# Altium project mach_relay_dao_chieu.PrjPcb
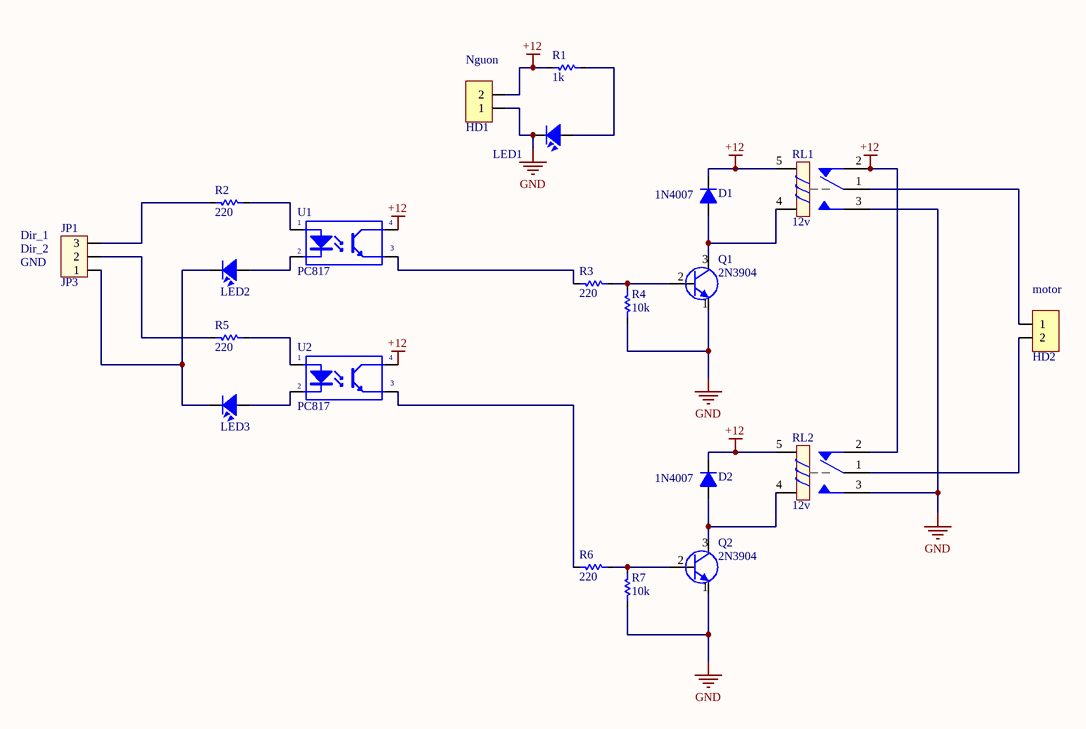
[diagram p0: mach_relay_dao_chieu.SchDoc]
1 sheet, 21 parts. Net scope: global (net labels, ports and power ports of the same name join across sheets).
Board file: mach_relay_dao_chieu.PcbDoc

## Sheet mach_relay_dao_chieu.SchDoc
size A; SheetNumber: 1; SheetTotal: 1

### Parts
D1  1N4007  [1N4007]
D2  1N4007  [1N4007]
HD1  Header 2  [KF301-2P]  (value not drawn)
HD2  Header 2  [KF301-2P]  (value not drawn)
JP1  JP3  [XH 2.54-3P]
LED1  LED  [LED-5MM-WHITE]  (value not drawn)
LED2  LED  [LED-5MM-WHITE]  (value not drawn)
LED3  LED  [LED-5MM-WHITE]  (value not drawn)
Q1  2N3904  [TO-92]
Q2  2N3904  [TO-92]
R1  1k  [RES-1/4W]
R2  220  [RES-1/4W]
R3  220  [RES-1/4W]
R4  10k  [RES-1/4W]
R5  220  [RES-1/4W]
R6  220  [RES-1/4W]
R7  10k  [RES-1/4W]
RL1  12v  [SRD-05VDC-SL-C]
RL2  12v  [SRD-05VDC-SL-C]
U1  PC817  [PC817]
U2  PC817  [PC817]

### Nets
+12: D1.2(K) D2.2(K) HD1.2 R1.2 RL1.2 RL1.5 RL2.2 RL2.5 U1.4(C) U2.4(C)
GND: HD1.1 LED1.2 Q1.1(E) Q2.1(E) R4.2 R7.2 RL1.3 RL2.3
NetD1_1: D1.1(A) Q1.3(C) RL1.4
NetD2_1: D2.1(A) Q2.3(C) RL2.4
NetHD2_1: HD2.1 RL1.1
NetHD2_2: HD2.2 RL2.1
NetJP1_1: JP1.1 LED2.2 LED3.2
NetJP1_2: JP1.2 R5.2
NetJP1_3: JP1.3 R2.2
NetLED1_1: LED1.1 R1.1
NetLED2_1: LED2.1 U1.2(K)
NetLED3_1: LED3.1 U2.2(K)
NetQ1_2: Q1.2(B) R3.1 R4.1
NetQ2_2: Q2.2(B) R6.1 R7.1
NetR2_1: R2.1 U1.1(A)
NetR3_2: R3.2 U1.3(E)
NetR5_1: R5.1 U2.1(A)
NetR6_2: R6.2 U2.3(E)

### Notes on the sheet
- (near HD1) Nguon
- (near JP1) GND
- (near JP1) Dir_2
- (near JP1) Dir_1
- (near HD2) motor

### Library data of the parts
D1 D2 = 1N4007: Diode 1N4007 1A 1000V; Value: 1N4148
HD1 HD2 = Header 2: Header, 2-Pin; Manufacturer: Generic Components; Class: Connector; Value: Header 2
JP1 = Con3: Header duc 3, Connector 3, Header 3; Value: Connector 3
LED1-LED3 = LED: LED Single; Value: LED 3 ly Single Colour
Q1 Q2 = 2N3904: NPN Transistor 0.2A 40V; Published: 8-Jun-2000; LatestRevisionDate: 15-Jan-2003; LatestRevisionNote: PCB Footprint 'BCY-W3/D4.7' replaced; DatasheetVersion: 1997; PackageVersion: Sep-1998; PackageReference: TO-92A; Publisher: Altium Limited; PackageDescription: TO, Flat Index; 3 In-Line, Axial Leads; Body Dia. 4.5mm; Leads 0.51 x 0.48 mm (max); ComponentLink1Description: Manufacturer Link; ComponentLink1URL: http://www.fairchildsemi.com/; ComponentLink2Description: Datasheet; ComponentLink2URL: http://www.fairchildsemi.com/ds/2N%2F2N3904.pdf
R1-R7 = Res1/4W: Tro cam
RL1 RL2 = Relay 1: Relay SPDT,10A - 12VDC 5 Pin; Value: Relay SPDT, 10A, 12V
U1 U2 = PC817: Single Opto; Value: PC817